# Altium schematic sheet Ethernet_Sheet.SchDoc: LAN8720
size 420 x 297 mm; Engineer: Zain Siddiqui; Revision: V3.2; SheetNumber: 7; SheetTotal: 8
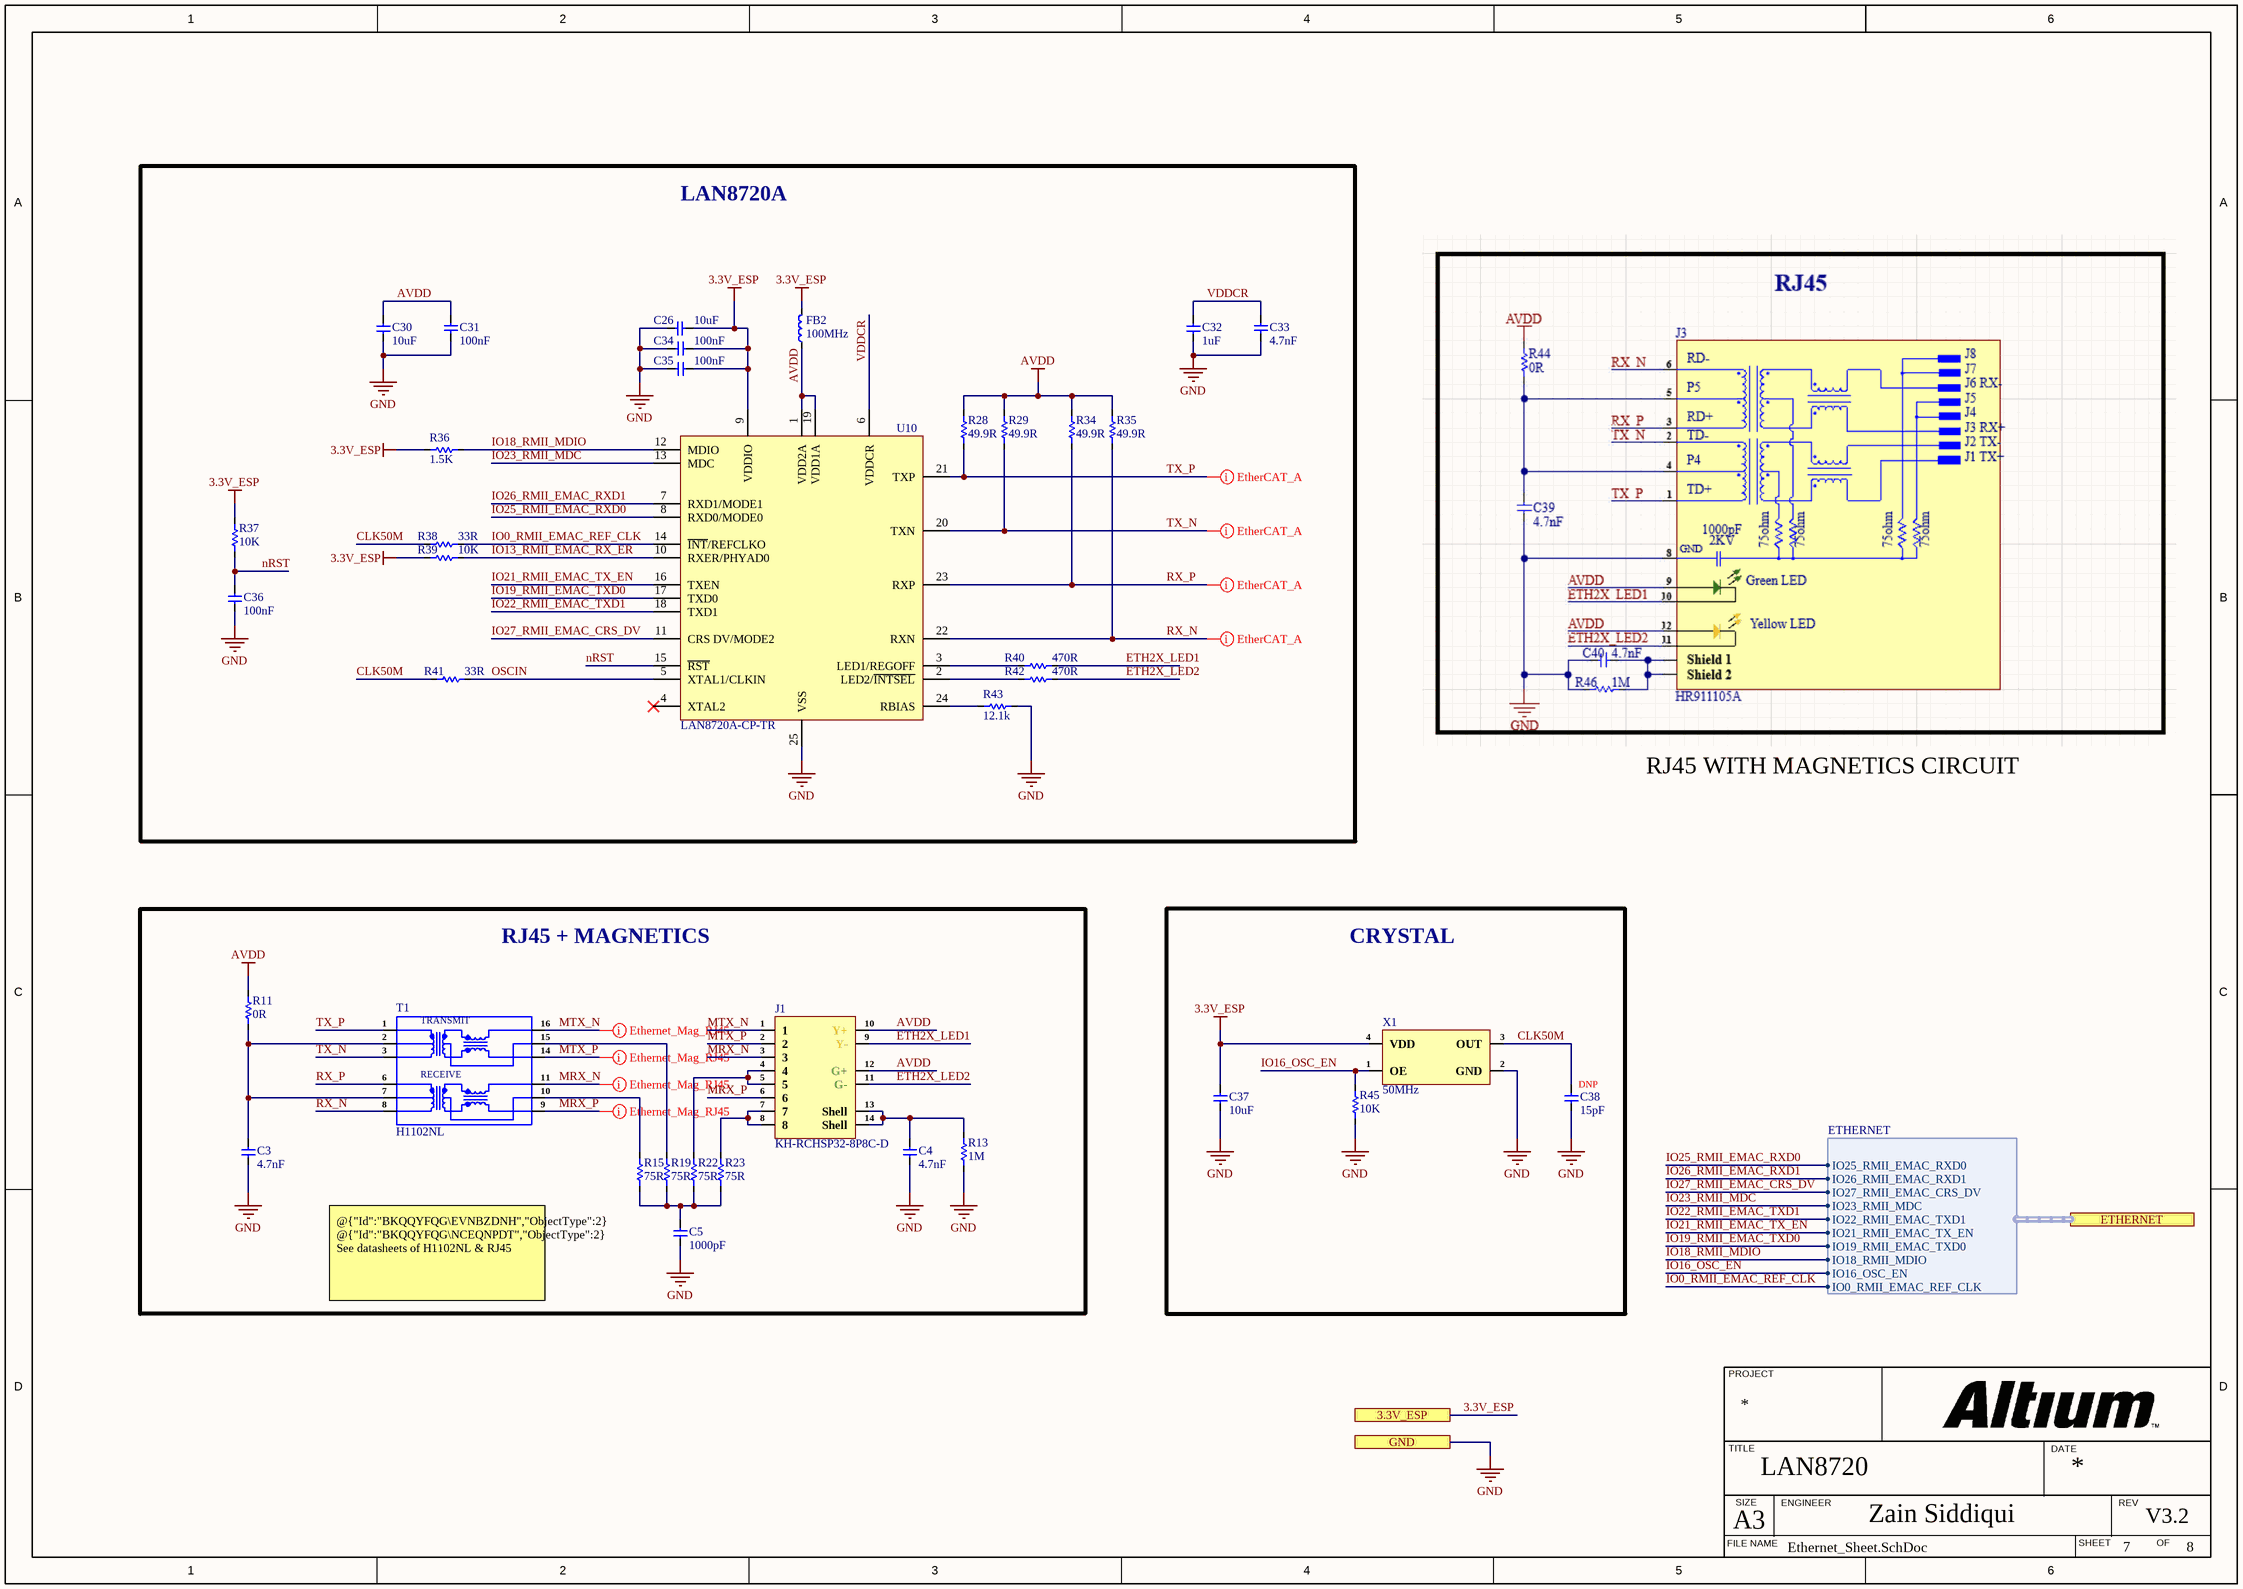
[diagram p0: Ethernet_Sheet.SchDoc]

## Parts
C3  4.7nF  [Cap-0402]
C4  4.7nF  [Cap-1206]
C5  1000pF  [Cap-1206]
C26  10uF  [Cap-0603]
C30  10uF  [Cap-0603]
C31  100nF  [cap-0402]
C32  1uF  [Cap-0402]
C33  4.7nF  [Cap-0402]
C34  100nF  [cap-0402]
C35  100nF  [cap-0402]
C36  100nF  [cap-0402]
C37  10uF  [Cap-0603]
C38  15pF  [Cap-0603]  (no BOM)
FB2  100MHz  [IND-1206]
J1  KH-RCHSP32-8P8C-D  [KH-RCHSP32-8P8C-D]
R11  0R  [Res-0402]
R13  1M  [Res-1206]
R15  75R  [Res-0402]
R19  75R  [Res-0402]
R22  75R  [Res-0402]
R23  75R  [Res-0402]
R28  49.9R  [Res-0402]
R29  49.9R  [Res-0402]
R34  49.9R  [Res-0402]
R35  49.9R  [Res-0402]
R36  1.5K  [Res-0402]
R37  10K  [Res-0402]
R38  33R  [Res-0402]
R39  10K  [Res-0402]
R40  470R  [Res-0402]
R41  33R  [Res-0402]
R42  470R  [Res-0402]
R43  12.1k  [Res-0402]
R45  10K  [Res-0402]
T1  H1102NL  [H1102NLT]
U10  LAN8720A-CP-TR  [LAN8720A-CP-TR]
X1  50MHz  [OT2EL4C4JI-111OLP-50M]

## Blocks framed on the sheet
LAN8720A: C26 C30-C36 FB2 R28 R29 R34-R43 U10
RJ45 + MAGNETICS: C3-C5 J1 R11 R13 R15 R19 R22 R23 T1
CRYSTAL: C37 C38 R45 X1

## Ports
3.3V_ESP (see Top_Sheet[5B], BattCharging_Sheet[2D], Controller_Sheet[3D], Display_Sheet[1D], FuelGauge_Sheet[2C], Power_Sheet[1D]), ETHERNET (harness ETHERNET, see Top_Sheet[5B], Controller_Sheet[3D]), GND (see Top_Sheet[5B], BattCharging_Sheet[2D], Controller_Sheet[3D], Display_Sheet[1D], FuelGauge_Sheet[2C], Power_Sheet[1D], USB_Sheet[3C])

## Harnesses
ETHERNET: IO25_RMII_EMAC_RXD0, IO26_RMII_EMAC_RXD1, IO27_RMII_EMAC_CRS_DV, IO23_RMII_MDC, IO22_RMII_EMAC_TXD1, IO21_RMII_EMAC_TX_EN, IO19_RMII_EMAC_TXD0, IO18_RMII_MDIO, IO16_OSC_EN, IO0_RMII_EMAC_REF_CLK

## Nets
3.3V_ESP: C26.2 C34.1 C35.1 C37.2 FB2.2 R36.2 R37.2 R39.2 U10.9(VDDIO) X1.4(VDD) ; port 3.3V_ESP
AVDD: C30.2 C31.1 FB2.1 J1.10(Y+) J1.12(G+) R11.2 R28.2 R29.2 R34.2 R35.2 U10.1(VDD2A) U10.19(VDD1A)
GND: C3.1 C4.1 C5.1 C26.1 C30.1 C31.2 C32.1 C33.2 C34.2 C35.2 C36.1 C37.1 C38.1 R13.1 R43.1 R45.2 U10.25(VSS) X1.2(GND) ; port GND
CLK50M: C38.2 R38.1 R41.1 X1.3(OUT)
ETH2X_LED1: J1.9(Y-) R40.2
ETH2X_LED2: J1.11(G-) R42.2
IO0_RMII_EMAC_REF_CLK: R38.2 U10.14(~{INT}/REFCLKO) ; port ETHERNET.IO0_RMII_EMAC_REF_CLK
IO13_RMII_EMAC_RX_ER: R39.1 U10.10(RXER/PHYAD0)
IO16_OSC_EN: R45.1 X1.1(OE) ; port ETHERNET.IO16_OSC_EN
IO18_RMII_MDIO: R36.1 U10.12(MDIO) ; port ETHERNET.IO18_RMII_MDIO
IO19_RMII_EMAC_TXD0: U10.17(TXD0) ; port ETHERNET.IO19_RMII_EMAC_TXD0
IO21_RMII_EMAC_TX_EN: U10.16(TXEN) ; port ETHERNET.IO21_RMII_EMAC_TX_EN
IO22_RMII_EMAC_TXD1: U10.18(TXD1) ; port ETHERNET.IO22_RMII_EMAC_TXD1
IO23_RMII_MDC: U10.13(MDC) ; port ETHERNET.IO23_RMII_MDC
IO25_RMII_EMAC_RXD0: U10.8(RXD0/MODE0) ; port ETHERNET.IO25_RMII_EMAC_RXD0
IO26_RMII_EMAC_RXD1: U10.7(RXD1/MODE1) ; port ETHERNET.IO26_RMII_EMAC_RXD1
IO27_RMII_EMAC_CRS_DV: U10.11(CRS_DV/MODE2) ; port ETHERNET.IO27_RMII_EMAC_CRS_DV
MRX_N: J1.3 T1.11
MRX_P: J1.6 T1.9
MTX_N: J1.1 T1.16
MTX_P: J1.2 T1.14
nRST: C36.2 R37.1 U10.15(~{RST})
OSCIN: R41.2 U10.5(XTAL1/CLKIN)
RX_N: R35.1 T1.8 U10.22(RXN)
RX_P: R34.1 T1.6 U10.23(RXP)
TX_N: R29.1 T1.3 U10.20(TXN)
TX_P: R28.1 T1.1 U10.21(TXP)
VDDCR: C32.2 C33.1 U10.6(VDDCR)
NetC3_2: C3.2 R11.1 T1.2 T1.7
NetC4_2: C4.2 J1.13(Shell) J1.14(Shell) R13.2
NetC5_2: C5.2 R15.2 R19.2 R22.2 R23.2
NetJ1_4: J1.4 J1.5 R22.1
NetJ1_7: J1.7 J1.8 R23.1
NetR15_1: R15.1 T1.10
NetR19_1: R19.1 T1.15
NetR40_1: R40.1 U10.3(LED1/REGOFF)
NetR42_1: R42.1 U10.2(LED2/~{INTSEL})
NetR43_2: R43.2 U10.24(RBIAS)

Not connected (* = marked no-connect by the designer): U10 4(XTAL2)*

## Layout directives
differential pair; differential pair class Ethernet_Lines; net class Ethernet; rule Matched Net Lengths [Tolerance = 20mil]; rule Impedance Constraint [Min = 97.00    Max = 105.0    ]: RX_N, RX_P, TX_N, TX_P
differential pair; differential pair class Ethernet_Mag_RJ45; net class Ethernet_Mag; rule Matched Net Lengths [Tolerance = 20mil]; rule Impedance Constraint [Min = 97.00    Max = 105.0    ]: MRX_N, MRX_P, MTX_N, MTX_P

## Notes on the sheet
- RJ45 WITH MAGNETICS CIRCUIT
- (near C38) DNP
- @{"Id":"BKQQYFQG\EVNBZDNH","ObjectType":2}
  @{"Id":"BKQQYFQG\NCEQNPDT","ObjectType":2}
  See datasheets of H1102NL & RJ45
- PROJECT
- TITLE
- DATE
- FILE NAME
- A3
- SIZE
- ENGINEER
- SHEET
- REV
- OF
- (in symbol H1102NL) TRANSMIT; RECEIVE

## Library data of the parts
C3 C33 = CC0402KRX7R9BB472: CAP CER 4700PF 50V X7R 0402; Manufacturer: Yageo; Material: 4241ConductorMaterial; Tolerance: 10%; Temperature Coefficient: 30ppm/°C; Item Type: Capacitor; Supplier 1: Future Electronics; Manufacturer Part Number: CC0402KRX7R9BB472; RoHS: Yes; Category: Ceramic Capacitors; Stock 1: 1780000; Pricing 1: 10000=0.0021, 40000=0.002, 150000=0.0019, 400000=0.0018, 1000000=0.0017 (USD); Mount: Surface Mount; Case/Package: 0402; Number of Pins: 2NUMBER; Case Code (Imperial): 0402; Case Code (Metric): 1005; Min Operating Temperature: -55°C; Max Operating Temperature: 125°C; Capacitance: 4.7nF; Dielectric: X7R; Voltage Rating: 50V; Voltage Rating (DC): 50V; Packaging: Tape and Reel; Package Quantity: 1; Termination: SMD/SMT; Series: CC; Construction: Flat; Length: 1mm; Width: 0.02inch; Height: 0.5mm; Thickness: 0.022inch; Depth: 0.5mm; Radiation Hardening: No; Reach SVHC Compliant: No; RoHS Compliant: Yes; Halogen Free: 5694HalogenFree; Lead Free: 5697LeadFree; ComponentLink1URL: https://datasheet.ciiva.com/7978/1489800-7978108.pdf?src-supplier=Element14; ComponentLink1Description: https://datasheet.ciiva.com/7978/1489800-7978108.pdf?src-supplier=Element14; ComponentLink2URL: https://datasheet.ciiva.com/176/mlccorderingcode-176364.pdf?src-supplier=Digikey; ComponentLink2Description: https://datasheet.ciiva.com/176/mlccorderingcode-176364.pdf?src-supplier=Digikey; ComponentLink3URL: https://datasheet.ciiva.com/176/mlccorderingcode-176363.pdf?src-supplier=Digikey; ComponentLink3Description: https://datasheet.ciiva.com/176/mlccorderingcode-176363.pdf?src-supplier=Digikey; ComponentLink4URL: https://datasheet.ciiva.com/176/mlccorderingcode-176365.pdf?src-supplier=Digikey; ComponentLink4Description: https://datasheet.ciiva.com/176/mlccorderingcode-176365.pdf?src-supplier=Digikey; ComponentLink5URL: https://datasheet.ciiva.com/11586/upy-gphc-x7r-6-3v-to-50v-8-11586491.pdf?src-supplier=Avnet; ComponentLink5Description: https://datasheet.ciiva.com/11586/upy-gphc-x7r-6-3v-to-50v-8-11586491.pdf?src-supplier=Avnet; Supplier Part Number 1: 1989300; LCSC Part Number: C106208
C4 = CC1206KKX7RCBB472: CAP CER 4700PF 1KV X7R 1206; Manufacturer: Yageo; Dielectric Material: Ceramic; Tolerance: 10%; Item Type: Capacitor; Supplier 1: Future Electronics; Manufacturer Part Number: CC1206KKX7RCBB472; RoHS: Yes; Category: Ceramic Capacitors; Stock 1: 180000; Pricing 1: 3000=0.02860, 9000=0.02750, 15000=0.02700, 45000=0.02600, 75000=0.02510 (USD); Mount: Surface Mount; Case/Package: 1206; Number of Pins: 2; Case Code (Imperial): 1206; Case Code (Metric): 3216; Weight: 0.000571oz; Min Operating Temperature: -55°C; Max Operating Temperature: 125°C; Voltage Rating: 1kV; Capacitance: 4.7nF; Packaging: Tape and Reel; Voltage Rating (DC): 1kV; Dielectric: X7R; Termination: SMD/SMT; Resistor Type: Ceramic; Series: CC; Length: 3.2mm; Width: 0.063inch; Thickness: 0.057inch; Depth: 1.6mm; Radiation Hardening: No; Lead Free: Lead Free; RoHS Compliant: Yes; ComponentLink1URL: https://datasheet.ciiva.com/13208/upy-gp-np0-16v-to-50v-8-13208693.pdf?src-supplier=Mouser; ComponentLink1Description: https://datasheet.ciiva.com/13208/upy-gp-np0-16v-to-50v-8-13208693.pdf?src-supplier=Mouser; ComponentLink2URL: https://datasheet.ciiva.com/11466/hv-11466701.pdf?src-supplier=Avnet; ComponentLink2Description: https://datasheet.ciiva.com/11466/hv-11466701.pdf?src-supplier=Avnet; Supplier Part Number 1: 7130131; LCSC Part Number: C107198
C5 = CC1206KKX7RDBB102: CAP CER 1000PF 2KV X7R 1206; Manufacturer: Yageo; Tolerance: 10%; Capacitance: 1nF; Dissipation Factor: 2.5%; Insulation Resistance: 10GR; Item Type: Capacitor; Supplier 1: Digi-Key; Manufacturer Part Number: CC1206KKX7RDBB102; RoHS: Yes; Category: Ceramic Capacitors; Stock 1: 19260; Pricing 1: 1=0.35000, 10=0.24000, 50=0.16780, 100=0.14390, 500=0.10794, 1000=0.09114 (USD); Mount: Surface Mount; Case/Package: 1206; Number of Pins: 2; Case Code (Metric): 3216; Case Code (Imperial): 1206; Min Operating Temperature: -55°C; Max Operating Temperature: 125°C; Dielectric: X7R; Voltage: 2kV; Package Quantity: 1; Voltage Rating: 2kV; Packaging: Tape and Reel; Voltage Rating (DC): 2kV; Termination: SMD/SMT; Resistor Type: Ceramic; Series: CC; Construction: Flat; Length: 3.2mm; Width: 0.063inch; Height: 1.25mm; Depth: 1.6mm; Thickness: 0.057inch; Radiation Hardening: No; RoHS Compliant: Yes; REACH SVHC: Unknown; Lead Free: Lead Free; ComponentLink1URL: https://datasheet.ciiva.com/23942/1449957-23942422.pdf?src-supplier=Newark; ComponentLink1Description: https://datasheet.ciiva.com/23942/1449957-23942422.pdf?src-supplier=Newark; ComponentLink2URL: https://datasheet.ciiva.com/186/upy-np0x7r-hv-1kv-to-3kv-4-186736.pdf?src-supplier=Digi-Key; ComponentLink2Description: https://datasheet.ciiva.com/186/upy-np0x7r-hv-1kv-to-3kv-4-186736.pdf?src-supplier=Digi-Key; ComponentLink3URL: https://datasheet.ciiva.com/186/upy-np0x7r-hv-1kv-to-3kv-4-186737.pdf?src-supplier=Digi-Key; ComponentLink3Description: https://datasheet.ciiva.com/186/upy-np0x7r-hv-1kv-to-3kv-4-186737.pdf?src-supplier=Digi-Key; ComponentLink4URL: https://datasheet.ciiva.com/13386/upy-gp-np0-16v-to-50v-8-13386312.pdf?src-supplier=Mouser; ComponentLink4Description: https://datasheet.ciiva.com/13386/upy-gp-np0-16v-to-50v-8-13386312.pdf?src-supplier=Mouser; ComponentLink5URL: https://datasheet.ciiva.com/186/upy-np0x7r-hv-1kv-to-3kv-4-186735.pdf?src-supplier=Digi-Key; ComponentLink5Description: https://datasheet.ciiva.com/186/upy-np0x7r-hv-1kv-to-3kv-4-186735.pdf?src-supplier=Digi-Key; Supplier Part Number 1: 311-1487-1-ND; LCSC Part Number: C23631
C26 C30 C37 = CL10A106MA8NRNC: CAP CER 10UF 25V X5R 0603; Manufacturer: Samsung; Tolerance: 20%; Supplier 1: Avnet; Manufacturer Part Number: CL10A106MA8NRNC; RoHS: Yes; Category: Ceramic Capacitors; Pricing 1: 4000=0.03753, 8000=0.03700, 16000=0.03595, 24000=0.03515, 32000=0.03383, 40000=0.03304, 400000=0.03225 (USD); Mount: Surface Mount; Case/Package: 0603; Case Code (Metric): 1608; Case Code (Imperial): 0603; Contact Plating: Tin; Min Operating Temperature: -55°C; Max Operating Temperature: 85°C; Package Quantity: 1; Packaging: Tape and Reel; Capacitance: 10uF; Voltage Rating: 25V; Dielectric: X5R; Termination: Wraparound; Series: CL; Construction: Flat; Length: 0.063inch; Width: 0.031inch; Thickness: 0.035inch; Lead Free: Lead Free; RoHS Compliant: Yes; ComponentLink1URL: https://datasheet.ciiva.com/25766/cl10a106ma8nrnc-25766562.pdf?src-supplier=Digi-Key; ComponentLink1Description: https://datasheet.ciiva.com/25766/cl10a106ma8nrnc-25766562.pdf?src-supplier=Digi-Key; Supplier Part Number 1: CL10A106MA8NRNC; LCSC Part Number: C96446
C31 C34-C36 = C1005X7R1H104KT000F: CAP CER 0.1UF 50V X7R 0402; Manufacturer: TDK; Tolerance: 10%; Voltage: 25V; Item Type: Capacitor; Supplier 1: Avnet; Manufacturer Part Number: C1005X7R1H104KT000F; RoHS: No; Category: Ceramic Capacitors; Dielectric: X7R; Supplier Part Number 1: C1005X7R1H104KT000F; LCSC Part Number: C361198; ComponentLink1Description: LCSC; ComponentLink1URL: https://www.lcsc.com/product-detail/Multilayer-Ceramic-Capacitors-MLCC-SMD-SMT_TDK-C1005X7R1H104KT000F_C361198.html
C32 = CC0402KRX5R7BB105: CAP CER 1UF 16V X5R 0402; Manufacturer: Yageo; Tolerance: 10%; Item Type: Capacitor; Supplier 1: Digi-Key; Manufacturer Part Number: CC0402KRX5R7BB105; Stock 1: 1405667; Pricing 1: 1=0.36, 10=0.252, 100=0.1512, 500=0.1134, 1000=0.09576, 2500=0.09072, 5000=0.08568 (USD); Mount: Surface Mount; Case/Package: 0402; Weight: 2.3E-05oz; Case Code (Imperial): 0402; Case Code (Metric): 1005; Min Operating Temperature: -55°C; Max Operating Temperature: 85°C; Capacitance: 1uF; Dielectric: X5R; Packaging: Tape and Reel; Voltage Rating (DC): 16V; Voltage Rating: 16V; Termination: SMD/SMT; Composition: Ceramic; Length: 1mm; Height: 0.5mm; Width: 0.02inch; Thickness: 0.022inch; Depth: 0.5mm; Radiation Hardening: No; Lead Free: Lead Free; Halogen Free: Halogen Free; ComponentLink1URL: http://www.yageo.com/documents/recent/UPY-GPHC_X5R_4V-to-50V_12.pdf?src-supplier=Avnet+Europe; ComponentLink1Description: http://www.yageo.com/documents/recent/UPY-GPHC_X5R_4V-to-50V_12.pdf?src-supplier=Avnet+Europe; Supplier Part Number 1: 311-1691-6-ND; LCSC Part Number: C325464
C38 = CC0603JRNPO9BN150: CAP CER 15PF 50V C0G/NPO 0603; Manufacturer: Yageo; Dielectric Material: Ceramic; Tolerance: 5%; Dielectric: C0G; Insulation Resistance: 100GR; Item Type: Capacitor; Supplier 1: Future Electronics; Manufacturer Part Number: CC0603JRNPO9BN150; RoHS: Yes; Category: Ceramic Capacitors; Stock 1: 832000; Pricing 1: 4000=0.0038, 16000=0.0036, 80000=0.0034, 160000=0.0033, 500000=0.0031 (USD); Mounting Technology: Surface Mount; Case/Package: 0603; Pins: 2; Case Code (Metric): 1608; Case Code (Imperial): 0603; Min Operating Temperature: -55°C; Max Operating Temperature: 125°C; Value: 15pF; Series: CC; Packaging: Tape and Reel; Package Quantity: 1; Termination: SMD/SMT; Voltage Rating: 50V; Length: 1.6mm; Width: 0.031inch; Height: 0.8mm; Depth: 0.8mm; Thickness: 0.035inch; Radiation Hardening: No; RoHS Compliant: Yes; Reach SVHC Compliant: No; Lead Free: Lead Free; ComponentLink1URL: https://datasheet.ciiva.com/144/mlccorderingcode-144635.pdf?src-supplier=Digi-Key; ComponentLink1Description: https://datasheet.ciiva.com/144/mlccorderingcode-144635.pdf?src-supplier=Digi-Key; ComponentLink2URL: https://datasheet.ciiva.com/144/mlccorderingcode-144636.pdf?src-supplier=Digi-Key; ComponentLink2Description: https://datasheet.ciiva.com/144/mlccorderingcode-144636.pdf?src-supplier=Digi-Key; ComponentLink3URL: https://datasheet.ciiva.com/8033/1443161-8033721.pdf?src-supplier=Element14; ComponentLink3Description: https://datasheet.ciiva.com/8033/1443161-8033721.pdf?src-supplier=Element14; ComponentLink4URL: https://datasheet.ciiva.com/28450/1443161-28450472.pdf?src-supplier=Element14; ComponentLink4Description: https://datasheet.ciiva.com/28450/1443161-28450472.pdf?src-supplier=Element14; ComponentLink5URL: https://datasheet.ciiva.com/144/mlccorderingcode-144634.pdf?src-supplier=Digi-Key; ComponentLink5Description: https://datasheet.ciiva.com/144/mlccorderingcode-144634.pdf?src-supplier=Digi-Key; ComponentLink6URL: https://datasheet.ciiva.com/8033/1734582-8033723.pdf?src-supplier=Element14; ComponentLink6Description: https://datasheet.ciiva.com/8033/1734582-8033723.pdf?src-supplier=Element14; ComponentLink7URL: https://datasheet.ciiva.com/8033/1734582-8033722.pdf?src-supplier=Element14; ComponentLink7Description: https://datasheet.ciiva.com/8033/1734582-8033722.pdf?src-supplier=Element14; ComponentLink8URL: https://datasheet.ciiva.com/11464/upy-gp-np0-16v-to-50v-8-11464727.pdf?src-supplier=Avnet; ComponentLink8Description: https://datasheet.ciiva.com/11464/upy-gp-np0-16v-to-50v-8-11464727.pdf?src-supplier=Avnet; Supplier Part Number 1: 4234670; LCSC Part Number: C107037
FB2 = BLM31PG121SN1L: FERRITE BEAD 120 OHM 1206 1LN; Manufacturer: Murata; Material: Steel,Ferrite; Tolerance: 25%; Impedance: 120R; Max Current Rating: 3.5A; Number of Lines: 1; DC Resistance (DCR): 20mR; Max DC Current: 3A; Shielding: Unshielded; Supplier 1: Avnet; Manufacturer Part Number: BLM31PG121SN1L; RoHS: Yes; Category: Ferrite Beads and Chips; Stock 1: 290640; Pricing 1: 3000=0.11563, 6000=0.10938, 12000=0.10313, 18000=0.09688, 24000=0.09063, 30000=0.08438, 300000=0.07813 (USD); Case/Package: 1206; Number of Pins: 2; Core Material: Ferrite; Case Code (Metric): 3216; Case Code (Imperial): 1206; Contact Plating: Tin,Matte; Min Operating Temperature: -55°C; Max Operating Temperature: 125°C; Package Quantity: 3000; Packaging: Tape and Reel; Current Rating: 3.5A; Termination: SMD/SMT; Test Frequency: 100MHz; DC Current: 3A; Frequency: 100MHz; Length: 3.2mm; Width: 1.6mm; Height: 1.1mm; Depth: 1.6mm; Radiation Hardening: No; Military Standard: Not; Lead Free: Lead Free; RoHS Compliant: Yes; ComponentLink1URL: https://datasheet.ciiva.com/19460/1845419-19460234.pdf?src-supplier=Jameco; ComponentLink1Description: https://datasheet.ciiva.com/19460/1845419-19460234.pdf?src-supplier=Jameco; ComponentLink2URL: https://datasheet.ciiva.com/1012/l0132s0193blm31p-1012992.pdf?src-supplier=Digi-Key; ComponentLink2Description: https://datasheet.ciiva.com/1012/l0132s0193blm31p-1012992.pdf?src-supplier=Digi-Key; ComponentLink3URL: https://datasheet.ciiva.com/11799/0900766b811b5866-11799444.pdf?src-supplier=RSComponents; ComponentLink3Description: https://datasheet.ciiva.com/11799/0900766b811b5866-11799444.pdf?src-supplier=RSComponents; ComponentLink4URL: https://datasheet.ciiva.com/3081/l0110s0100blm31p-3081665.pdf?src-supplier=Avnet; ComponentLink4Description: https://datasheet.ciiva.com/3081/l0110s0100blm31p-3081665.pdf?src-supplier=Avnet; ComponentLink5URL: https://datasheet.ciiva.com/41449/001172383-da-01-en-drossel-1206-120r-3-2x1-60mm-3000st-41449554.pdf?src-supplier=Conrad; ComponentLink5Description: https://datasheet.ciiva.com/41449/001172383-da-01-en-drossel-1206-120r-3-2x1-60mm-3000st-41449554.pdf?src-supplier=Conrad; ComponentLink6URL: https://datasheet.ciiva.com/29348/442557-da-01-en-chip-drossel-1206-120r-3000ma-3-2x1-60mm-29348014.pdf?src-supplier=Conrad; ComponentLink6Description: https://datasheet.ciiva.com/29348/442557-da-01-en-chip-drossel-1206-120r-3000ma-3-2x1-60mm-29348014.pdf?src-supplier=Conrad; ComponentLink7URL: https://datasheet.ciiva.com/14122/apblm31p-data-e-14122856.pdf?src-supplier=Distrelec; ComponentLink7Description: https://datasheet.ciiva.com/14122/apblm31p-data-e-14122856.pdf?src-supplier=Distrelec; ComponentLink8URL: https://datasheet.ciiva.com/48436/blm31pg121sn1l-eng-tds-48436731.pdf?src-supplier=Distrelec; ComponentLink8Description: https://datasheet.ciiva.com/48436/blm31pg121sn1l-eng-tds-48436731.pdf?src-supplier=Distrelec; ComponentLink9URL: https://datasheet.ciiva.com/1012/l0110s0100blm31p-1012991.pdf?src-supplier=Digi-Key; ComponentLink9Description: https://datasheet.ciiva.com/1012/l0110s0100blm31p-1012991.pdf?src-supplier=Digi-Key; ComponentLink10URL: https://datasheet.ciiva.com/1012/l0110s0100blm31p-1012993.pdf?src-supplier=Digi-Key; ComponentLink10Description: https://datasheet.ciiva.com/1012/l0110s0100blm31p-1012993.pdf?src-supplier=Digi-Key; ComponentLink11URL: https://datasheet.ciiva.com/3081/l0110s0100blm31p-3081666.pdf?src-supplier=Avnet; ComponentLink11Description: https://datasheet.ciiva.com/3081/l0110s0100blm31p-3081666.pdf?src-supplier=Avnet; ComponentLink12URL: https://datasheet.ciiva.com/16390/l0110s0100blm31p-16390857.pdf?src-supplier=Future+Electronics; ComponentLink12Description: https://datasheet.ciiva.com/16390/l0110s0100blm31p-16390857.pdf?src-supplier=Future+Electronics; ComponentLink13URL: https://datasheet.ciiva.com/18093/getdatasheetpartid-152966-18093084.pdf?src-supplier=Verical; ComponentLink13Description: https://datasheet.ciiva.com/18093/getdatasheetpartid-152966-18093084.pdf?src-supplier=Verical; Supplier Part Number 1: BLM31PG121SN1L; LCSC Part Number: C85841; Item Type: Ferrite Bead
J1 = KH-RCHSP32-8P8C-D: Jack Modular Connector RJ45 Through Hole, Right Angle Shielded; Manufacturer: kinghelm; Manufacturer Part Number: KH-RCHSP32-8P8C-D; LCSC Part Number: C2828084; Item Type: RJ45; Package: Through Hole,Right Angle; ComponentLink1Description: LCSC Link; ComponentLink1URL: https://www.lcsc.com/product-detail/C2828084.html?s_z=n_KH-RCHSP32-8P8C-D
R11 = RC0402FR-070RL: RES 0 OHM JUMPER 1/16W 0402; Manufacturer: Yageo; Item Type: Resistors; Tolerance: 1%; Power Rating: 62.5mW; Voltage Rating: 50V; Temperature Coefficient: 200ppm/°C; Max Power Dissipation: 63mW; Supplier 1: Mouser; Manufacturer Part Number: RC0402FR-070RL; RoHS: Yes; Stock 1: 8556842; Pricing 1: 1=0.10000, 10=0.01400, 50=0.01400, 100=0.00600, 1000=0.00300, 5000=0.00200, 10000=0.00100 (USD); Mount: Surface Mount; Case/Package: 0402; Contact Plating: Tin,Matte; Case Code (Imperial): 0402; Case Code (Metric): 1005; Size Code: 0402; Min Operating Temperature: -55°C; Max Operating Temperature: 155°C; Resistance: 0R; Resistor Type: Thick Film; Packaging: Tape and Reel; Termination: SMD/SMT; Features: Moisture Resistant; Series: RC; Number of Terminations: 2; Length: 1mm; Width: 0.5mm; Height: 0.35mm; Radiation Hardening: No; Lead Free: Lead Free; RoHS Compliant: Yes; ComponentLink1URL: https://datasheet.ciiva.com/8896/pyu-rc0402-51-rohs-l-6-8896149.pdf?src-supplier=Avnet; ComponentLink1Description: https://datasheet.ciiva.com/8896/pyu-rc0402-51-rohs-l-6-8896149.pdf?src-supplier=Avnet; ComponentLink2URL: https://datasheet.ciiva.com/16790/pyu-rc0402-51-rohs-l-6-r-16790444.pdf?src-supplier=Future+Electronics; ComponentLink2Description: https://datasheet.ciiva.com/16790/pyu-rc0402-51-rohs-l-6-r-16790444.pdf?src-supplier=Future+Electronics; Supplier Part Number 1: 603-RC0402FR-070RL; LCSC Part Number: C106231
R13 = RC1206FR-071ML: RES 1M OHM 1% 1/4W 1206; Manufacturer: Yageo; Resistance: 1MR; Temperature Coefficient: 100ppm/°C; Power Rating: 250mW; Voltage Rating: 200V; Item Type: Resistor; Supplier 1: Avnet; Manufacturer Part Number: RC1206FR-071ML; RoHS: Yes; Category: Chip SMD Resistors; Stock 1: 935000; Pricing 1: 5000=0.00412, 10000=0.00406, 20000=0.00394 (USD); Case/Package: 1206; Case Code (Imperial): 1206; Case Code (Metric): 3216; Size Code: 1206; Min Operating Temperature: -55°C; Max Operating Temperature: 155°C; Tolerance: 1%; Packaging: Tape and Reel; Resistor Type: Thick Film; Package Quantity: 5000; Termination: SMD/SMT; Features: Moisture Resistant; Series: RC; Max Power Dissipation: 250mW; Number of Terminations: 2; Technology: THICK FILM; Resistance Tolerance: 1%; Construction: Rectangular; Length: 3.1mm; Width: 1.6mm; Height: 0.55mm; Depth: 1.6mm; Lead Free: Lead Free; Military Standard: Not; RoHS Compliant: Yes; ComponentLink1URL: https://datasheet.ciiva.com/11819/0900766b80c6630a-11819912.pdf?src-supplier=RSComponents; ComponentLink1Description: https://datasheet.ciiva.com/11819/0900766b80c6630a-11819912.pdf?src-supplier=RSComponents; ComponentLink2URL: https://datasheet.ciiva.com/46445/444357-46445709.pdf?src-supplier=Element14; ComponentLink2Description: https://datasheet.ciiva.com/46445/444357-46445709.pdf?src-supplier=Element14; ComponentLink3URL: https://datasheet.ciiva.com/7857/444357-7857289.pdf?src-supplier=Element14; ComponentLink3Description: https://datasheet.ciiva.com/7857/444357-7857289.pdf?src-supplier=Element14; ComponentLink4URL: https://datasheet.ciiva.com/7857/444357-7857288.pdf?src-supplier=Element14; ComponentLink4Description: https://datasheet.ciiva.com/7857/444357-7857288.pdf?src-supplier=Element14; ComponentLink5URL: https://datasheet.ciiva.com/17033/pyu-rc1206-51-rohs-l-4-17033611.pdf?src-supplier=Future+Electronics; ComponentLink5Description: https://datasheet.ciiva.com/17033/pyu-rc1206-51-rohs-l-4-17033611.pdf?src-supplier=Future+Electronics; Supplier Part Number 1: RC1206FR-071ML; LCSC Part Number: C108083
R15 R19 R22 R23 = RC0402FR-0775RL: 75Ω ±1% 62.5mW 0402 Thick Film Resistor; Manufacturer: YAGEO; Item Type: SMD Resistor; Manufacturer Part Number: RC0402FR-0775RL; LCSC Part Number: C114757; Package: 0402; ComponentLink1Description: LCSC Link; ComponentLink1URL: https://www.lcsc.com/product-detail/C114757.html
R28 R29 R34 R35 = RC0402FR-0749R9L: 49.9Ω 62.5mW 50V ±100ppm/℃ Thick Film Resistor ±1% 0402 Chip Resistor - Surface Mount ROHS; Manufacturer: YAGEO; Manufacturer Part Number: RC0402FR-0749R9L; LCSC Part Number: C87044; Item Type: Resistor; Package: 0402; ComponentLink1Description: LCSC Link; ComponentLink1URL: https://www.lcsc.com/product-detail/C87044.html
R36 = RC0402FR-071K5L: RES 1.5K OHM 1% 1/16W 0402; Manufacturer: Yageo; Resistance: 1.5kR; Power Rating: 62.5mW; Voltage Rating: 50V; Temperature Coefficient: 100ppm/°C; Max Power Dissipation: 63mW; Supplier 1: Digi-Key; Manufacturer Part Number: RC0402FR-071K5L; RoHS: Yes; Category: Chip SMD Resistors; Stock 1: 2832947; Pricing 1: 1=0.10000, 10=0.01500, 100=0.00610, 1000=0.00275, 2500=0.00239, 5000=0.00197 (USD); Case/Package: 0402; Case Code (Metric): 1005; Case Code (Imperial): 0402; Size Code: 0402; Min Operating Temperature: -55°C; Max Operating Temperature: 155°C; Resistor Type: Thick Film; Package Quantity: 1; Tolerance: 1%; Packaging: Tape and Reel; Number of Terminations: 2; Termination: SMD/SMT; Features: Moisture Resistant; Series: RC; Resistance Tolerance: 1%; Construction: Rectangular; Technology: THICK FILM; Length: 1mm; Width: 0.02inch; Height: 0.016inch; Depth: 0.5mm; RoHS Compliant: Yes; REACH SVHC: No SVHC; Military Standard: Not; Lead Free: Lead Free; ComponentLink1URL: https://datasheet.ciiva.com/11808/0900766b80c66297-11808238.pdf?src-supplier=RSComponents; ComponentLink1Description: https://datasheet.ciiva.com/11808/0900766b80c66297-11808238.pdf?src-supplier=RSComponents; ComponentLink2URL: https://datasheet.ciiva.com/46394/1018594-46394950.pdf?src-supplier=Element14; ComponentLink2Description: https://datasheet.ciiva.com/46394/1018594-46394950.pdf?src-supplier=Element14; ComponentLink3URL: https://datasheet.ciiva.com/2453/pyu-r-int-thick-7-2453440.pdf?src-supplier=Digi-Key; ComponentLink3Description: https://datasheet.ciiva.com/2453/pyu-r-int-thick-7-2453440.pdf?src-supplier=Digi-Key; ComponentLink4URL: https://datasheet.ciiva.com/2453/pyu-r-int-thick-7-2453441.pdf?src-supplier=Digi-Key; ComponentLink4Description: https://datasheet.ciiva.com/2453/pyu-r-int-thick-7-2453441.pdf?src-supplier=Digi-Key; ComponentLink5URL: https://datasheet.ciiva.com/2453/pyu-r-int-thick-7-2453439.pdf?src-supplier=Digi-Key; ComponentLink5Description: https://datasheet.ciiva.com/2453/pyu-r-int-thick-7-2453439.pdf?src-supplier=Digi-Key; ComponentLink6URL: https://datasheet.ciiva.com/12558/pyu-rc0402-51-rohs-l-6-r-8721-12558542.pdf?src-supplier=Mouser; ComponentLink6Description: https://datasheet.ciiva.com/12558/pyu-rc0402-51-rohs-l-6-r-8721-12558542.pdf?src-supplier=Mouser; ComponentLink7URL: https://datasheet.ciiva.com/7849/1018594-7849863.pdf?src-supplier=Element14; ComponentLink7Description: https://datasheet.ciiva.com/7849/1018594-7849863.pdf?src-supplier=Element14; ComponentLink8URL: https://datasheet.ciiva.com/7849/1018594-7849864.pdf?src-supplier=Element14; ComponentLink8Description: https://datasheet.ciiva.com/7849/1018594-7849864.pdf?src-supplier=Element14; ComponentLink9URL: https://datasheet.ciiva.com/15189/getdatasheetpartid-323992-15189370.pdf?src-supplier=Verical; ComponentLink9Description: https://datasheet.ciiva.com/15189/getdatasheetpartid-323992-15189370.pdf?src-supplier=Verical; Supplier Part Number 1: 311-1.50KLRCT-ND; LCSC Part Number: C114759
R37 R39 R45 = RC0402FR-0710KL: RES 10K OHM 1% 1/16W 0402; Manufacturer: Yageo; Resistance: 10kR; Voltage Rating (DC): 50V; Temperature Coefficient: 100ppm/°C; Power Rating: 62.5mW; Max Power Dissipation: 63mW; Item Type: Resistor; Supplier 1: Mouser; Manufacturer Part Number: RC0402FR-0710KL; RoHS: Yes; Category: Chip SMD Resistors; Stock 1: 18648329; Pricing 1: 1=0.10000, 10=0.01400, 50=0.01400, 100=0.00500, 1000=0.00300, 10000=0.00200 (USD); Case/Package: 0402; Number of Pins: 2; Case Code (Imperial): 0402; Case Code (Metric): 1005; Min Operating Temperature: -55°C; Max Operating Temperature: 155°C; Resistor Type: Thick Film; Tolerance: 1%; Packaging: Tape and Reel; Voltage Rating: 50V; Termination: SMD/SMT; Working Voltage: 50V; Number of Terminations: 2; Features: Moisture Resistant; Series: RC; Resistance Tolerance: 1%; Construction: Rectangular; Length: 1mm; Width: 0.5mm; Height: 0.32mm; Depth: 0.5mm; Lead Pitch: 0.2mm; REACH SVHC: No SVHC; Lead Free: Lead Free; RoHS Compliant: Yes; Military Standard: Not; ComponentLink1URL: https://datasheet.ciiva.com/7660/38568-7660787.pdf?src-supplier=Element14; ComponentLink1Description: https://datasheet.ciiva.com/7660/38568-7660787.pdf?src-supplier=Element14; ComponentLink2URL: https://datasheet.ciiva.com/7849/1686128-7849814.pdf?src-supplier=Element14; ComponentLink2Description: https://datasheet.ciiva.com/7849/1686128-7849814.pdf?src-supplier=Element14; ComponentLink3URL: https://datasheet.ciiva.com/7983/1018594-7983486.pdf?src-supplier=Element14; ComponentLink3Description: https://datasheet.ciiva.com/7983/1018594-7983486.pdf?src-supplier=Element14; ComponentLink4URL: https://datasheet.ciiva.com/22747/1018594-22747512.pdf?src-supplier=Element14; ComponentLink4Description: https://datasheet.ciiva.com/22747/1018594-22747512.pdf?src-supplier=Element14; ComponentLink5URL: https://datasheet.ciiva.com/12667/pyu-rc0402-51-rohs-l-6-r-12667067.pdf?src-supplier=Mouser; ComponentLink5Description: https://datasheet.ciiva.com/12667/pyu-rc0402-51-rohs-l-6-r-12667067.pdf?src-supplier=Mouser; ComponentLink6URL: https://datasheet.ciiva.com/7849/1784430-7849813.pdf?src-supplier=Element14; ComponentLink6Description: https://datasheet.ciiva.com/7849/1784430-7849813.pdf?src-supplier=Element14; ComponentLink7URL: https://datasheet.ciiva.com/7849/1784430-7849815.pdf?src-supplier=Element14; ComponentLink7Description: https://datasheet.ciiva.com/7849/1784430-7849815.pdf?src-supplier=Element14; Supplier Part Number 1: 603-RC0402FR-0710KL; LCSC Part Number: C60490
R38 R41 = RC0402FR-0733RL: RES 33 OHM 1% 1/16W 0402; Manufacturer: Yageo; Power Rating: 62.5mW; Voltage Rating: 50V; Temperature Coefficient: 100ppm/°C; Max Power Dissipation: 63mW; Supplier 1: Mouser; Manufacturer Part Number: RC0402FR-0733RL; RoHS: Yes; Category: Chip SMD Resistors; Stock 1: 1843488; Pricing 1: 1=0.10000, 10=0.01200, 50=0.01200, 100=0.00500, 1000=0.00300, 10000=0.00100 (USD); Case/Package: 0402; Number of Pins: 2; Case Code (Imperial): 0402; Case Code (Metric): 1005; Size Code: 0402; Min Operating Temperature: -55°C; Max Operating Temperature: 155°C; Resistor Type: Thick Film; Resistance: 33R; Tolerance: 1%; Packaging: Tape and Reel; Voltage Rating (DC): 50V; Package Quantity: 10000; Termination: SMD/SMT; Features: Moisture Resistant; Series: RC; Number of Terminations: 2; Resistance Tolerance: 1%; Construction: Rectangular; Technology: THICK FILM; Length: 1mm; Width: 0.5mm; Height: 0.35mm; Depth: 0.5mm; RoHS Compliant: Yes; REACH SVHC: Unknown; Military Standard: Not; Lead Free: Lead Free; ComponentLink1URL: https://datasheet.ciiva.com/11819/0900766b80c66297-11819487.pdf?src-supplier=RSComponents; ComponentLink1Description: https://datasheet.ciiva.com/11819/0900766b80c66297-11819487.pdf?src-supplier=RSComponents; ComponentLink2URL: https://datasheet.ciiva.com/24070/pyu-rc0402-51-rohs-l-6-r-8721-24070077.pdf?src-supplier=Mouser; ComponentLink2Description: https://datasheet.ciiva.com/24070/pyu-rc0402-51-rohs-l-6-r-8721-24070077.pdf?src-supplier=Mouser; ComponentLink3URL: https://datasheet.ciiva.com/7849/1018594-7849967.pdf?src-supplier=Element14; ComponentLink3Description: https://datasheet.ciiva.com/7849/1018594-7849967.pdf?src-supplier=Element14; ComponentLink4URL: https://datasheet.ciiva.com/7849/1018594-7849966.pdf?src-supplier=Element14; ComponentLink4Description: https://datasheet.ciiva.com/7849/1018594-7849966.pdf?src-supplier=Element14; ComponentLink5URL: https://datasheet.ciiva.com/15189/getdatasheetpartid-329253-15189431.pdf?src-supplier=Verical; ComponentLink5Description: https://datasheet.ciiva.com/15189/getdatasheetpartid-329253-15189431.pdf?src-supplier=Verical; ComponentLink6URL: https://datasheet.ciiva.com/17070/pyu-rc0402-51-rohs-l-6-r-17070335.pdf?src-supplier=Future+Electronics; ComponentLink6Description: https://datasheet.ciiva.com/17070/pyu-rc0402-51-rohs-l-6-r-17070335.pdf?src-supplier=Future+Electronics; Supplier Part Number 1: 603-RC0402FR-0733RL; LCSC Part Number: C138002
R40 R42 = RC0402FR-07470RL: RES 470 OHM 1% 1/16W 0402; Manufacturer: Yageo; Item Type: Resistor; Voltage Rating: 50V; Power Rating: 62.5mW; Temperature Coefficient: 100ppm/°C; Max Power Dissipation: 63mW; Supplier: Avnet; Supplier Part Number: RC0402FR-07470RL; Manufacturer Part Number: RC0402FR-07470RL; RoHS: Yes; Stock: 10000; Pricing: 10000=0.00085 (USD); Case/Package: 0402; Case Code (Metric): 1005; Case Code (Imperial): 0402; Min Operating Temperature: -55°C; Max Operating Temperature: 155°C; Packaging: Tape and Reel; Value: 470R; Tolerance: 1%; Number of Terminations: 2; Working Voltage: 50V; Package Quantity: 1; Resistor Type: Thick Film; Termination: SMD/SMT; Features: Moisture Resistant; Series: RC; Resistance Tolerance: 1%; Construction: Rectangular; Voltage Rating (AC): 50V; Length: 1mm; Width: 0.02inch; Height: 0.016inch; Depth: 0.5mm; Lead Free: Lead Free; Reach SVHC Compliant: No; RoHS Compliant: Yes; Military Standard: Not; ComponentLink1URL: https://datasheet.ciiva.com/46412/1018594-46412838.pdf?src-supplier=Element14; ComponentLink1Description: https://datasheet.ciiva.com/46412/1018594-46412838.pdf?src-supplier=Element14; ComponentLink2URL: https://datasheet.ciiva.com/2453/pyu-r-int-thick-7-2453377.pdf?src-supplier=Digikey; ComponentLink2Description: https://datasheet.ciiva.com/2453/pyu-r-int-thick-7-2453377.pdf?src-supplier=Digikey; ComponentLink3URL: https://datasheet.ciiva.com/2453/pyu-r-int-thick-7-2453378.pdf?src-supplier=Digikey; ComponentLink3Description: https://datasheet.ciiva.com/2453/pyu-r-int-thick-7-2453378.pdf?src-supplier=Digikey; ComponentLink4URL: https://datasheet.ciiva.com/2453/pyu-r-int-thick-7-2453376.pdf?src-supplier=Digikey; ComponentLink4Description: https://datasheet.ciiva.com/2453/pyu-r-int-thick-7-2453376.pdf?src-supplier=Digikey; ComponentLink5URL: https://datasheet.ciiva.com/7850/1018594-7850015.pdf?src-supplier=Element14; ComponentLink5Description: https://datasheet.ciiva.com/7850/1018594-7850015.pdf?src-supplier=Element14; ComponentLink6URL: https://datasheet.ciiva.com/7850/1018594-7850014.pdf?src-supplier=Element14; ComponentLink6Description: https://datasheet.ciiva.com/7850/1018594-7850014.pdf?src-supplier=Element14; ComponentLink7URL: https://datasheet.ciiva.com/15189/getdatasheetpartid-330246-15189463.pdf?src-supplier=Verical; ComponentLink7Description: https://datasheet.ciiva.com/15189/getdatasheetpartid-330246-15189463.pdf?src-supplier=Verical; LCSC Part Number: C114877
R43 = RT0402BRD0712K1L: RES SMD 12.1KOHM 0.1% 1/16W 0402; Manufacturer: Yageo; Item Type: Resistor; Supplier: Future Electronics; Supplier Part Number: 2068365; Manufacturer Part Number: RT0402BRD0712K1L; RoHS: Yes; Category: Chip SMD Resistors; Stock: 60000; Pricing: 10000=0.0245, 20000=0.0217, 30000=0.0237, 50000=0.0233, 100000=0.0228, 200000=0.022 (USD); ComponentLink1URL: https://datasheet.ciiva.com/12812/pyu-rt-1-to-0-05-rohs-l-4-12812462.pdf?src-supplier=Mouser; ComponentLink1Description: https://datasheet.ciiva.com/12812/pyu-rt-1-to-0-05-rohs-l-4-12812462.pdf?src-supplier=Mouser; LCSC Part Number: C281773
T1 = H1102NL: XFRMR MAGNETIC 1PORT 1:1 10/100; Manufacturer: Pulse; Shielding: Unshielded; Isolation Voltage: 1.5kV; Insertion Loss: -1.1dB; Return Loss: -11.5dB; Lead/Base Style: Gull Wing; DC Resistance (DCR): 650mR; Value: 350uH; Item Type: RJ45 Transformer; Supplier: Avnet; Supplier Part Number: H1102NL; Manufacturer Part Number: H1102NL; RoHS: Yes; Category: Transformers; Stock: 500; Pricing: 1=3.05066, 10=2.98754, 30=2.92442, 50=2.8613, 100=2.79819, 250=2.73507, 500=2.68247 (USD); Mounting Technology: Surface Mount; Case/Package: Module; Pins: 16; Weight: 0.098767oz; Min Operating Temperature: 0°C; Max Operating Temperature: 70°C; Packaging: Rail/Tube; Package Quantity: 40; Turns Ratio: 1:1; Termination: SMD/SMT; Series: -; Length: 12.7mm; Width: 7.11mm; Height: 6.09mm; Depth: 9.53mm; Height - Seated (Max): 6.22mm; Radiation Hardening: No; RoHS Compliant: Yes; Lead Free: Lead Free; ComponentLink1URL: https://datasheet.ciiva.com/2938/10-100base-tsingleportsmdmagnetics-rev2008-2938779.pdf?src-supplier=Digikey; ComponentLink1Description: https://datasheet.ciiva.com/2938/10-100base-tsingleportsmdmagnetics-rev2008-2938779.pdf?src-supplier=Digikey; LCSC Part Number: C18584
U10 = LAN8720A-CP-TR: IC TRANSCEIVER FULL 2/2 24SQFN; Manufacturer: MICROCHIP; Simplex/Duplex: Full Duplex; Item Type: RMII; Max Operating Temperature: 85°C; Packaging: Tape and Reel; Min Operating Temperature: 0°C; Mount: Surface Mount; Manufacturer Part Number: LAN8720A-CP-TR; LCSC Part Number: C45223; Package: QFN-24-EP(4x4); ComponentLink1Description: LCSC Link; ComponentLink1URL: https://www.lcsc.com/product-detail/C45223.html?s_z=n_LAN8720A
X1 = OT2EL4C4JI-111OLP-50M: 1.8V~3.3V ±10ppm ±20ppm CMOS 50MHz SMD3225-4P Crystal Oscillators ROHS; Manufacturer: YXC Crystal Oscillators; Manufacturer Part Number: OT2EL4C4JI-111OLP-50M; LCSC Part Number: C5203552; Item Type: Crystal; Package: SMD3225-4P; ComponentLink1Description: LCSC Link; ComponentLink1URL: https://lcsc.com/product-detail/Crystal-Oscillators_YXC-Crystal-Oscillators-OT2EL4C4JI-111OLP-50M_C5203552.html